# Altium schematic sheet 浓度探头.SchDoc
size A4
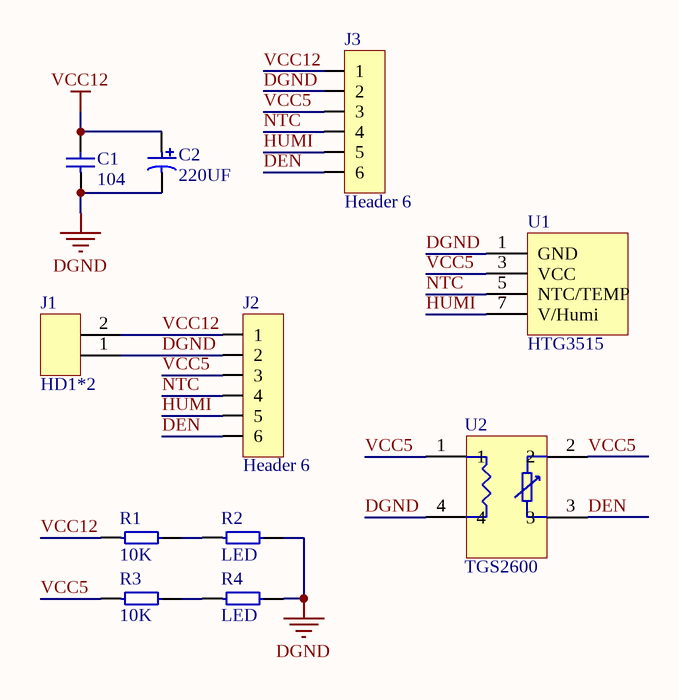
[diagram p0: 浓度探头.SchDoc]

## Parts
C1  104  [0805C]
C2  220UF  [RB 2.5/6.3]
J1  HD1*2  [XH2.54-2P]
J2  Header 6  [HDR1X6]
J3  Header 6  [HDR1X6]
R1  10K  [0805]
R2  LED  [0805]
R3  10K  [0805]
R4  LED  [0805]
U1  HTG3515  [HD2*4-2.0]
U2  TGS2600  [TGS2600]

## Nets
DGND: C1.1 C2.1 J1.1 J2.2 J3.2 R2.2 R4.2 U1.1(GND) U2.4
VCC12: C1.2 C2.2 J1.2 J2.1 J3.1 R1.1
DEN: J2.6 J3.6 U2.3
HUMI: J2.5 J3.5 U1.7(V/Humi)
NTC: J2.4 J3.4 U1.5(NTC/TEMP)
VCC5: J2.3 J3.3 R3.1 U1.3(VCC) U2.1 U2.2
NetR1_2: R1.2 R2.1
NetR3_2: R3.2 R4.1

## Library data of the parts
C1 = CAP
C2 = CAP-POL2
R1-R4 = Res